# Altium project Led panel 0.2.PrjPcb
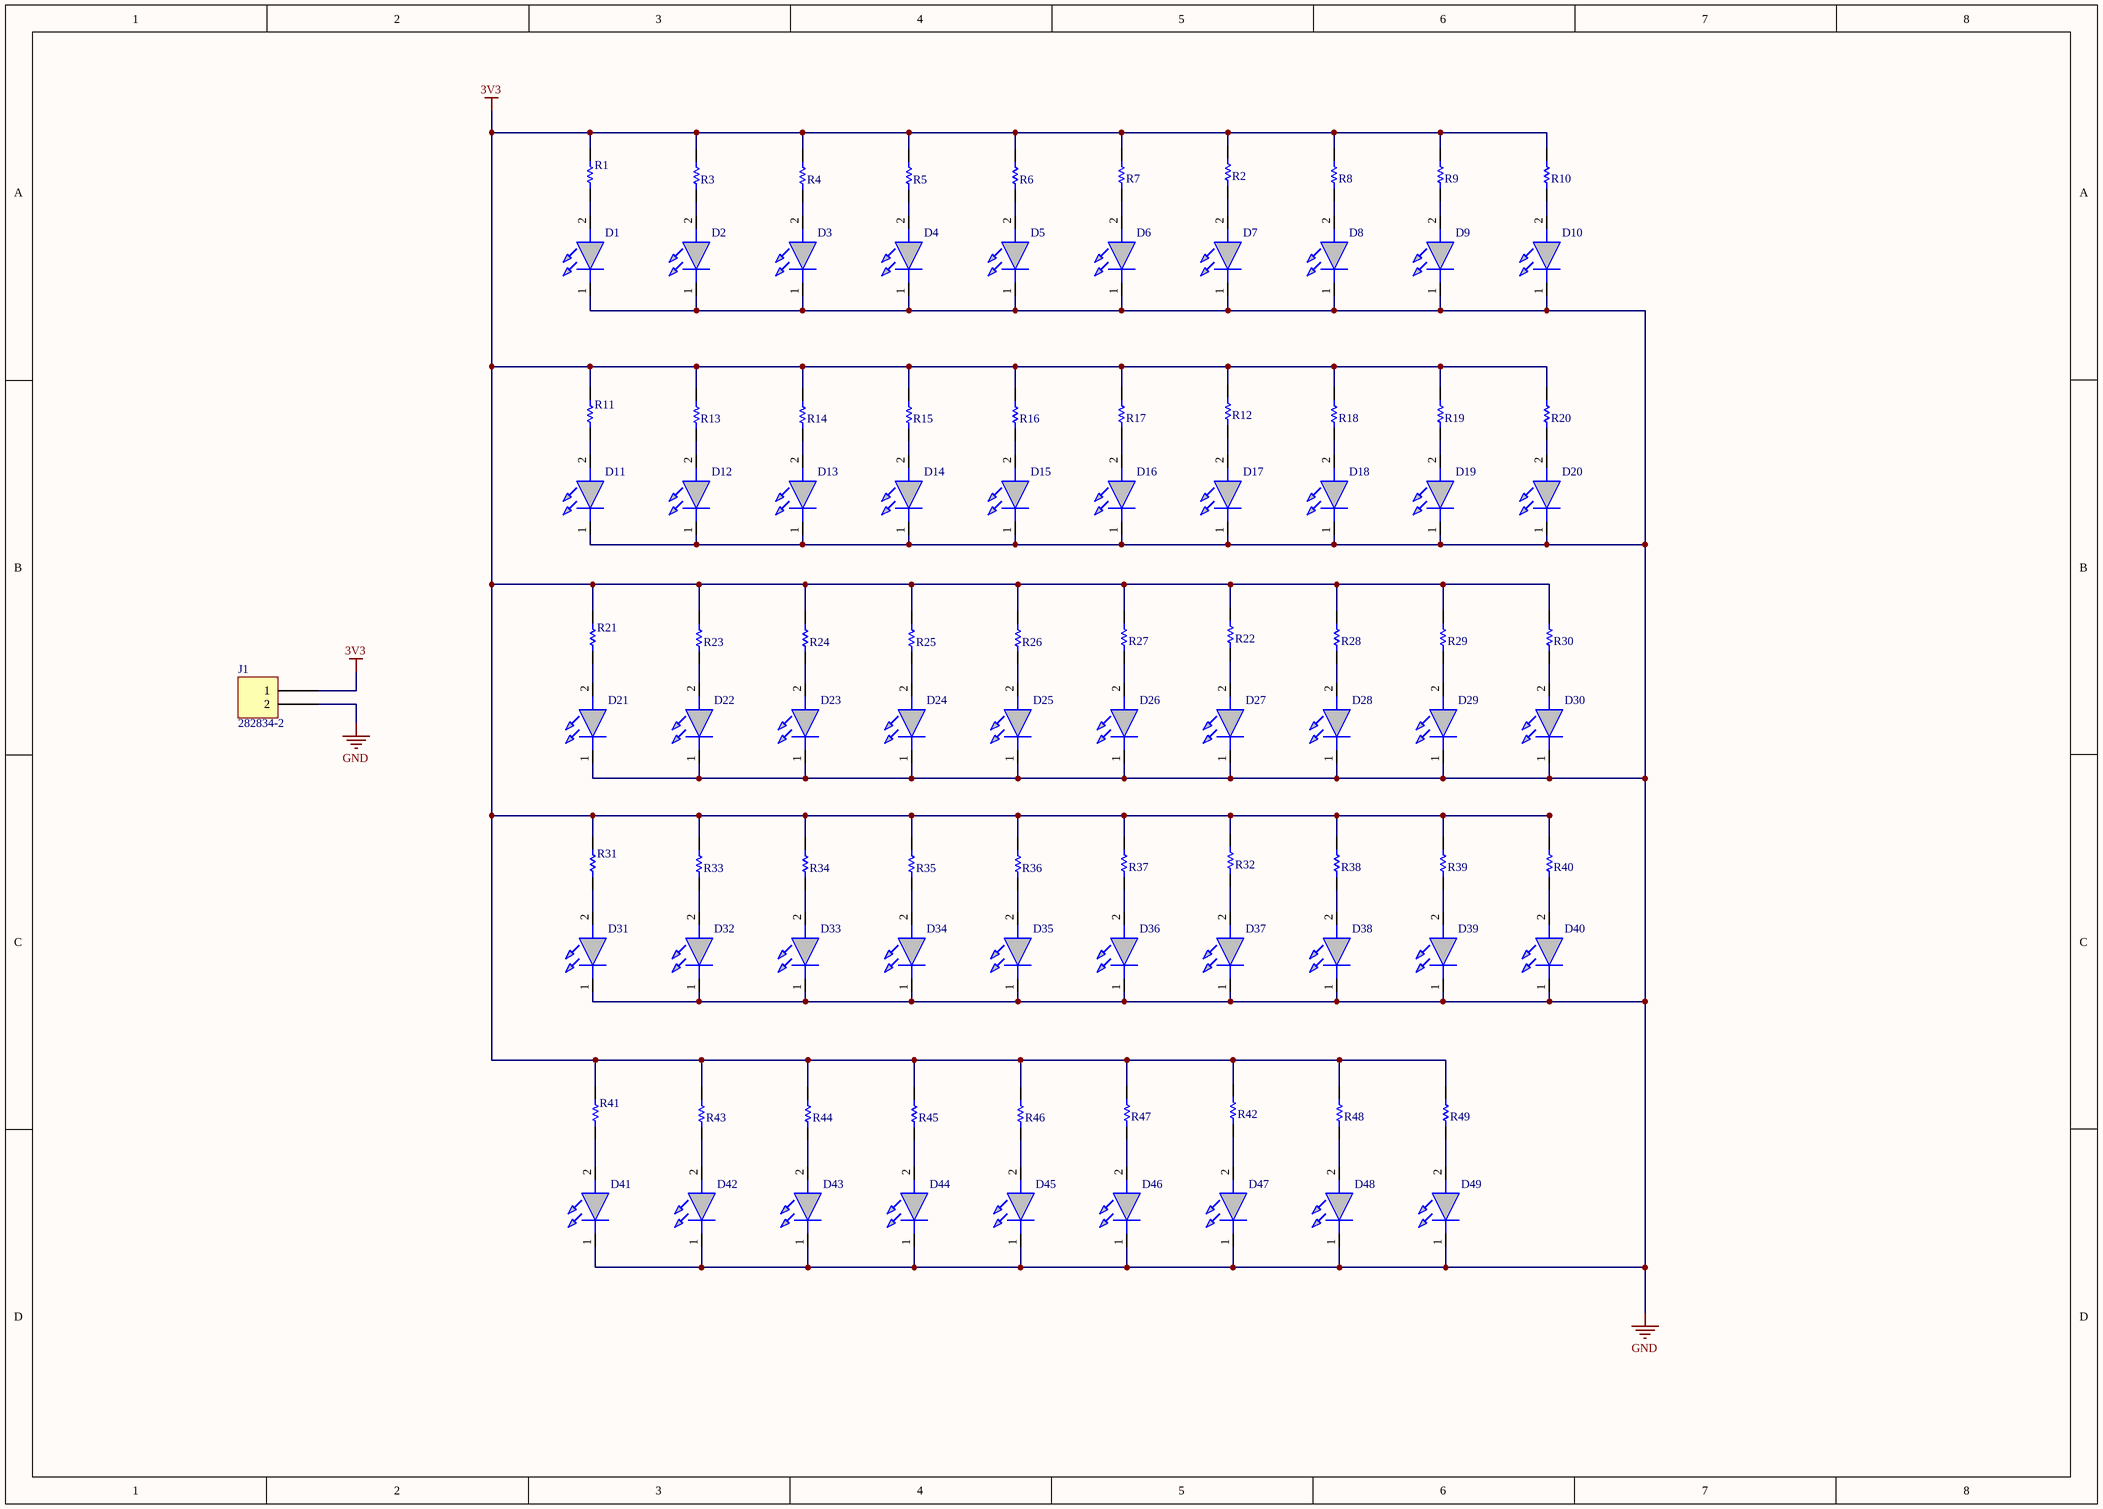
[diagram p0: Led panel 0.2.SchDoc]
1 sheet, 99 parts. Net scope: global (net labels, ports and power ports of the same name join across sheets).
Board file: Led panel 0.2.PcbDoc

## Sheet Led panel 0.2.SchDoc
size A3; SheetNumber: 1; SheetTotal: 1

### Parts
D1  L1IG-0750100000000  [L1IG0750100000000]  (value not drawn)
D2  L1IG-0750100000000  [L1IG0750100000000]  (value not drawn)
D3  L1IG-0750100000000  [L1IG0750100000000]  (value not drawn)
D4  L1IG-0750100000000  [L1IG0750100000000]  (value not drawn)
D5  L1IG-0750100000000  [L1IG0750100000000]  (value not drawn)
D6  L1IG-0750100000000  [L1IG0750100000000]  (value not drawn)
D7  L1IG-0750100000000  [L1IG0750100000000]  (value not drawn)
D8  L1IG-0750100000000  [L1IG0750100000000]  (value not drawn)
D9  L1IG-0750100000000  [L1IG0750100000000]  (value not drawn)
D10  L1IG-0750100000000  [L1IG0750100000000]  (value not drawn)
D11  L1IG-0750100000000  [L1IG0750100000000]  (value not drawn)
D12  L1IG-0750100000000  [L1IG0750100000000]  (value not drawn)
D13  L1IG-0750100000000  [L1IG0750100000000]  (value not drawn)
D14  L1IG-0750100000000  [L1IG0750100000000]  (value not drawn)
D15  L1IG-0750100000000  [L1IG0750100000000]  (value not drawn)
D16  L1IG-0750100000000  [L1IG0750100000000]  (value not drawn)
D17  L1IG-0750100000000  [L1IG0750100000000]  (value not drawn)
D18  L1IG-0750100000000  [L1IG0750100000000]  (value not drawn)
D19  L1IG-0750100000000  [L1IG0750100000000]  (value not drawn)
D20  L1IG-0750100000000  [L1IG0750100000000]  (value not drawn)
D21  L1IG-0750100000000  [L1IG0750100000000]  (value not drawn)
D22  L1IG-0750100000000  [L1IG0750100000000]  (value not drawn)
D23  L1IG-0750100000000  [L1IG0750100000000]  (value not drawn)
D24  L1IG-0750100000000  [L1IG0750100000000]  (value not drawn)
D25  L1IG-0750100000000  [L1IG0750100000000]  (value not drawn)
D26  L1IG-0750100000000  [L1IG0750100000000]  (value not drawn)
D27  L1IG-0750100000000  [L1IG0750100000000]  (value not drawn)
D28  L1IG-0750100000000  [L1IG0750100000000]  (value not drawn)
D29  L1IG-0750100000000  [L1IG0750100000000]  (value not drawn)
D30  L1IG-0750100000000  [L1IG0750100000000]  (value not drawn)
D31  L1IG-0750100000000  [L1IG0750100000000]  (value not drawn)
D32  L1IG-0750100000000  [L1IG0750100000000]  (value not drawn)
D33  L1IG-0750100000000  [L1IG0750100000000]  (value not drawn)
D34  L1IG-0750100000000  [L1IG0750100000000]  (value not drawn)
D35  L1IG-0750100000000  [L1IG0750100000000]  (value not drawn)
D36  L1IG-0750100000000  [L1IG0750100000000]  (value not drawn)
D37  L1IG-0750100000000  [L1IG0750100000000]  (value not drawn)
D38  L1IG-0750100000000  [L1IG0750100000000]  (value not drawn)
D39  L1IG-0750100000000  [L1IG0750100000000]  (value not drawn)
D40  L1IG-0750100000000  [L1IG0750100000000]  (value not drawn)
D41  L1IG-0750100000000  [L1IG0750100000000]  (value not drawn)
D42  L1IG-0750100000000  [L1IG0750100000000]  (value not drawn)
D43  L1IG-0750100000000  [L1IG0750100000000]  (value not drawn)
D44  L1IG-0750100000000  [L1IG0750100000000]  (value not drawn)
D45  L1IG-0750100000000  [L1IG0750100000000]  (value not drawn)
D46  L1IG-0750100000000  [L1IG0750100000000]  (value not drawn)
D47  L1IG-0750100000000  [L1IG0750100000000]  (value not drawn)
D48  L1IG-0750100000000  [L1IG0750100000000]  (value not drawn)
D49  L1IG-0750100000000  [L1IG0750100000000]  (value not drawn)
J1  282834-2  [TE 282834-2]
R1  RC0805FR-0710KL  [RESC2013X60X35NL10T20]  (value not drawn)
R2  RC0805FR-0710KL  [RESC2013X60X35NL10T20]  (value not drawn)
R3  RC0805FR-0710KL  [RESC2013X60X35NL10T20]  (value not drawn)
R4  RC0805FR-0710KL  [RESC2013X60X35NL10T20]  (value not drawn)
R5  RC0805FR-0710KL  [RESC2013X60X35NL10T20]  (value not drawn)
R6  RC0805FR-0710KL  [RESC2013X60X35NL10T20]  (value not drawn)
R7  RC0805FR-0710KL  [RESC2013X60X35NL10T20]  (value not drawn)
R8  RC0805FR-0710KL  [RESC2013X60X35NL10T20]  (value not drawn)
R9  RC0805FR-0710KL  [RESC2013X60X35NL10T20]  (value not drawn)
R10  RC0805FR-0710KL  [RESC2013X60X35NL10T20]  (value not drawn)
R11  RC0805FR-0710KL  [RESC2013X60X35NL10T20]  (value not drawn)
R12  RC0805FR-0710KL  [RESC2013X60X35NL10T20]  (value not drawn)
R13  RC0805FR-0710KL  [RESC2013X60X35NL10T20]  (value not drawn)
R14  RC0805FR-0710KL  [RESC2013X60X35NL10T20]  (value not drawn)
R15  RC0805FR-0710KL  [RESC2013X60X35NL10T20]  (value not drawn)
R16  RC0805FR-0710KL  [RESC2013X60X35NL10T20]  (value not drawn)
R17  RC0805FR-0710KL  [RESC2013X60X35NL10T20]  (value not drawn)
R18  RC0805FR-0710KL  [RESC2013X60X35NL10T20]  (value not drawn)
R19  RC0805FR-0710KL  [RESC2013X60X35NL10T20]  (value not drawn)
R20  RC0805FR-0710KL  [RESC2013X60X35NL10T20]  (value not drawn)
R21  RC0805FR-0710KL  [RESC2013X60X35NL10T20]  (value not drawn)
R22  RC0805FR-0710KL  [RESC2013X60X35NL10T20]  (value not drawn)
R23  RC0805FR-0710KL  [RESC2013X60X35NL10T20]  (value not drawn)
R24  RC0805FR-0710KL  [RESC2013X60X35NL10T20]  (value not drawn)
R25  RC0805FR-0710KL  [RESC2013X60X35NL10T20]  (value not drawn)
R26  RC0805FR-0710KL  [RESC2013X60X35NL10T20]  (value not drawn)
R27  RC0805FR-0710KL  [RESC2013X60X35NL10T20]  (value not drawn)
R28  RC0805FR-0710KL  [RESC2013X60X35NL10T20]  (value not drawn)
R29  RC0805FR-0710KL  [RESC2013X60X35NL10T20]  (value not drawn)
R30  RC0805FR-0710KL  [RESC2013X60X35NL10T20]  (value not drawn)
R31  RC0805FR-0710KL  [RESC2013X60X35NL10T20]  (value not drawn)
R32  RC0805FR-0710KL  [RESC2013X60X35NL10T20]  (value not drawn)
R33  RC0805FR-0710KL  [RESC2013X60X35NL10T20]  (value not drawn)
R34  RC0805FR-0710KL  [RESC2013X60X35NL10T20]  (value not drawn)
R35  RC0805FR-0710KL  [RESC2013X60X35NL10T20]  (value not drawn)
R36  RC0805FR-0710KL  [RESC2013X60X35NL10T20]  (value not drawn)
R37  RC0805FR-0710KL  [RESC2013X60X35NL10T20]  (value not drawn)
R38  RC0805FR-0710KL  [RESC2013X60X35NL10T20]  (value not drawn)
R39  RC0805FR-0710KL  [RESC2013X60X35NL10T20]  (value not drawn)
R40  RC0805FR-0710KL  [RESC2013X60X35NL10T20]  (value not drawn)
R41  RC0805FR-0710KL  [RESC2013X60X35NL10T20]  (value not drawn)
R42  RC0805FR-0710KL  [RESC2013X60X35NL10T20]  (value not drawn)
R43  RC0805FR-0710KL  [RESC2013X60X35NL10T20]  (value not drawn)
R44  RC0805FR-0710KL  [RESC2013X60X35NL10T20]  (value not drawn)
R45  RC0805FR-0710KL  [RESC2013X60X35NL10T20]  (value not drawn)
R46  RC0805FR-0710KL  [RESC2013X60X35NL10T20]  (value not drawn)
R47  RC0805FR-0710KL  [RESC2013X60X35NL10T20]  (value not drawn)
R48  RC0805FR-0710KL  [RESC2013X60X35NL10T20]  (value not drawn)
R49  RC0805FR-0710KL  [RESC2013X60X35NL10T20]  (value not drawn)

### Nets
3V3: J1.1 R1.2 R2.2 R3.2 R4.2 R5.2 R6.2 R7.2 R8.2 R9.2 R10.2 R11.2 R12.2 R13.2 R14.2 R15.2 R16.2 R17.2 R18.2 R19.2 R20.2 R21.2 R22.2 R23.2 R24.2 R25.2 R26.2 R27.2 R28.2 R29.2 R30.2 R31.2 R32.2 R33.2 R34.2 R35.2 R36.2 R37.2 R38.2 R39.2 R40.2 R41.2 R42.2 R43.2 R44.2 R45.2 R46.2 R47.2 R48.2 R49.2
GND: D1.1(K) D2.1(K) D3.1(K) D4.1(K) D5.1(K) D6.1(K) D7.1(K) D8.1(K) D9.1(K) D10.1(K) D11.1(K) D12.1(K) D13.1(K) D14.1(K) D15.1(K) D16.1(K) D17.1(K) D18.1(K) D19.1(K) D20.1(K) D21.1(K) D22.1(K) D23.1(K) D24.1(K) D25.1(K) D26.1(K) D27.1(K) D28.1(K) D29.1(K) D30.1(K) D31.1(K) D32.1(K) D33.1(K) D34.1(K) D35.1(K) D36.1(K) D37.1(K) D38.1(K) D39.1(K) D40.1(K) D41.1(K) D42.1(K) D43.1(K) D44.1(K) D45.1(K) D46.1(K) D47.1(K) D48.1(K) D49.1(K) J1.2
NetD1_2: D1.2(A) R1.1
NetD2_2: D2.2(A) R3.1
NetD3_2: D3.2(A) R4.1
NetD4_2: D4.2(A) R5.1
NetD5_2: D5.2(A) R6.1
NetD6_2: D6.2(A) R7.1
NetD7_2: D7.2(A) R2.1
NetD8_2: D8.2(A) R8.1
NetD9_2: D9.2(A) R9.1
NetD10_2: D10.2(A) R10.1
NetD11_2: D11.2(A) R11.1
NetD12_2: D12.2(A) R13.1
NetD13_2: D13.2(A) R14.1
NetD14_2: D14.2(A) R15.1
NetD15_2: D15.2(A) R16.1
NetD16_2: D16.2(A) R17.1
NetD17_2: D17.2(A) R12.1
NetD18_2: D18.2(A) R18.1
NetD19_2: D19.2(A) R19.1
NetD20_2: D20.2(A) R20.1
NetD21_2: D21.2(A) R21.1
NetD22_2: D22.2(A) R23.1
NetD23_2: D23.2(A) R24.1
NetD24_2: D24.2(A) R25.1
NetD25_2: D25.2(A) R26.1
NetD26_2: D26.2(A) R27.1
NetD27_2: D27.2(A) R22.1
NetD28_2: D28.2(A) R28.1
NetD29_2: D29.2(A) R29.1
NetD30_2: D30.2(A) R30.1
NetD31_2: D31.2(A) R31.1
NetD32_2: D32.2(A) R33.1
NetD33_2: D33.2(A) R34.1
NetD34_2: D34.2(A) R35.1
NetD35_2: D35.2(A) R36.1
NetD36_2: D36.2(A) R37.1
NetD37_2: D37.2(A) R32.1
NetD38_2: D38.2(A) R38.1
NetD39_2: D39.2(A) R39.1
NetD40_2: D40.2(A) R40.1
NetD41_2: D41.2(A) R41.1
NetD42_2: D42.2(A) R43.1
NetD43_2: D43.2(A) R44.1
NetD44_2: D44.2(A) R45.1
NetD45_2: D45.2(A) R46.1
NetD46_2: D46.2(A) R47.1
NetD47_2: D47.2(A) R42.1
NetD48_2: D48.2(A) R48.1
NetD49_2: D49.2(A) R49.1

### Library data of the parts
D1-D49 = L1IG-0750100000000: Infrared Emitters - High Power Broadrange IR LED 600 - 1050nm; Manufacturer_Name: Lumileds; Mouser Part Number: 997-L1IG075010000; Mouser Price/Stock: https://www.mouser.co.uk/ProductDetail/Lumileds/L1IG-0750100000000?qs=UXgszm6BlbFsaqyaTO4YIQ%3D%3D; Manufacturer_Part_Number: L1IG-0750100000000; Datasheet Link: https://www.lumileds.com/uploads/838/DS263-luxeon-ir-onyx-datasheet-pdf
J1 = 282834-2: TERM BLK 2P SIDE ENT 2.54MM PCB; Manufacturer: TE Connectivity AMP Connectors; Current: 10A; Mating Orientation: Horizontal with Board; Number of Levels: 1; Pitch: 0.100" (2.54mm); Positions Per Level: 2; Voltage: 150V; Wire Gauge: 16-30 AWG; Wire Termination: Screw - Rising Cage Clamp; Part Number: 282834-2; Color: Green; ComponentLink1Description: Datasheet; ComponentLink1URL: https://www.te.com/commerce/DocumentDelivery/DDEController?Action=srchrtrv&DocNm=282834&DocType=Customer+Drawing&DocLang=English; ComponentLink2Description: DigiKey Link; ComponentLink2URL: http://digikey.com/product-detail/en/te-connectivity-amp-connectors/282834-2/A98333-ND/1150135; LastUpdated: 1/15/2020 4:15:38 AM; Lifecycle Status: Active; Minimum Order: 1; Mounting Type: Through Hole; Packaging: Bulk; Part Status: Active; Price: 0.88; Series: Buchanan; Supplier 1: DigiKey; Supplier Part Number 1: A98333-ND
R1-R49 = CMP-1659-00013-4: Chip Resistor, 10 KOhm, +/- 1%, 0.125 W, -55 to 155 degC, 0805 (2012 Metric), RoHS, Tape and Reel; Manufacturer: Yageo; Voltage Rating: 150 V; Mount: Surface Mount; ComponentLink1Description: Manufacturer URL; ComponentLink2URL: http://www.yageo.com/documents/recent/PYu-RC_Group_51_RoHS_L_04.pdf; Pins: 2; Length: 2 mm; Min Operating Temperature: -55 degC; Height: 0.5 mm; Mounting Technology: Surface Mount; RoHSCompliant: true; REACH SVHC: No SVHC; ComponentLink1URL: http://www.yageo.com/; Max Operating Temperature: 155 degC; PackageReference: 0805; DatasheetVersion: Rev. 4, 02/2016; Package Quantity: 5000; Packaging: Tape and Reel; ComponentLink2Description: Datasheet; PackageDescription: 2-Pin Surface Mounted Device, Body 2 x 1.25 mm